# Altium schematic sheet [6] Audio, Full bridge.SchDoc
size A4; DocumentNumber: 9; SheetNumber: 9; SheetTotal: 10
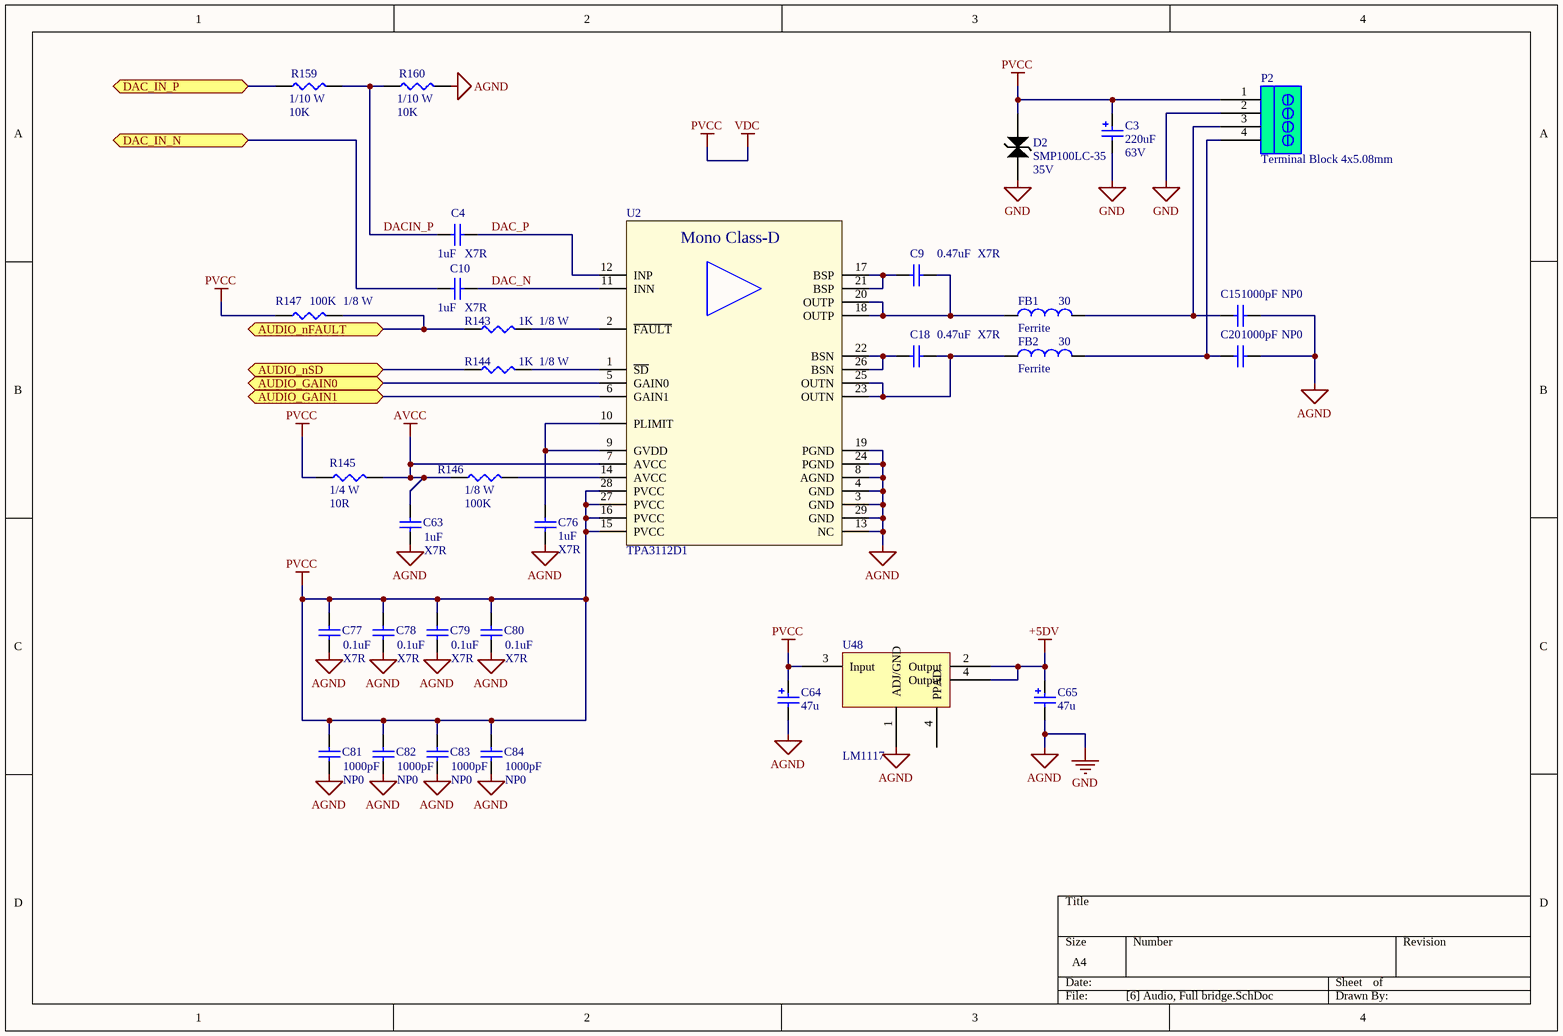
[diagram p0: [6] Audio, Full bridge.SchDoc]

## Parts
C3  value 220uF  Voltage: 63V  [CAPPR5-10x17_1]  (hidden comment: Cap Pol 100/47)
C4  value 1uF  Type: X7R  [CAP0805]  (hidden comment: CAP0805 1uF X7R)
C9  value 0.47uF  Type: X7R  [CAP0603]  (hidden comment: ChipCap 0.47u X7R)
C10  value 1uF  Type: X7R  [CAP0805]  (hidden comment: CAP0805 1uF X7R)
C15  value 1000pF  Type: NP0  [CAP0805]  (hidden comment: CAP0805 1000pF NP0)
C18  value 0.47uF  Type: X7R  [CAP0603]  (hidden comment: ChipCap 0.47u X7R)
C20  value 1000pF  Type: NP0  [CAP0805]  (hidden comment: CAP0805 1000pF NP0)
C63  value 1uF  Type: X7R  [CAP0805]  (hidden comment: CAP0805 1uF X7R)
C64  value 47u  [CAPC7343]  (hidden comment: Cap Pol SMD)
C65  value 47u  [CAPC7343]  (hidden comment: Cap Pol SMD)
C76  value 1uF  Type: X7R  [CAP0805]  (hidden comment: CAP0805 1uF X7R)
C77  value 0.1uF  Type: X7R  [CAP0805]  (hidden comment: CAP0805 0.1uF X7R)
C78  value 0.1uF  Type: X7R  [CAP0805]  (hidden comment: CAP0805 0.1uF X7R)
C79  value 0.1uF  Type: X7R  [CAP0805]  (hidden comment: CAP0805 0.1uF X7R)
C80  value 0.1uF  Type: X7R  [CAP0805]  (hidden comment: CAP0805 0.1uF X7R)
C81  value 1000pF  Type: NP0  [CAP0603]  (hidden comment: ChipCap 1000 NP0)
C82  value 1000pF  Type: NP0  [CAP0603]  (hidden comment: ChipCap 1000 NP0)
C83  value 1000pF  Type: NP0  [CAP0603]  (hidden comment: ChipCap 1000 NP0)
C84  value 1000pF  Type: NP0  [CAP0603]  (hidden comment: ChipCap 1000 NP0)
D2  SMP100LC-35  Voltage: 35V  [SMB1]
FB1  Ferrite  value 30  [RES0805]
FB2  Ferrite  value 30  [RES0805]
P2  Terminal Block 4x5.08mm  [Socket 4x5.08]
R143  value 1K  Rating: 1/8 W  [RES0805]  (hidden comment: RES0805 1K 1%)
R144  value 1K  Rating: 1/8 W  [RES0805]  (hidden comment: RES0805 1K 1%)
R145  value 10R  Rating: 1/4 W  [RES1206]  (hidden comment: RES1206 10R 1%)
R146  value 100K  Rating: 1/8 W  [RES0805]  (hidden comment: RES0805 100K 1%)
R147  value 100K  Rating: 1/8 W  [RES0805]  (hidden comment: RES0805 100K 1%)
R159  value 10K  Rating: 1/10 W  [RES0603]  (hidden comment: RES0603 10K 1%)
R160  value 10K  Rating: 1/10 W  [RES0603]  (hidden comment: RES0603 10K 1%)
U2  TPA3112D1  [TSSOP-28]
U48  LM1117  [SOT223-4M]

## Ports
AUDIO_GAIN0, AUDIO_GAIN1, AUDIO_nFAULT, AUDIO_nSD, DAC_IN_N, DAC_IN_P

## Nets
+5DV: C65.1 U48.2(Output) U48.4(PPAD)
AGND: C3.2 C15.2 C20.2 C63.1 C64.2 C65.2 C76.2 C77.1 C78.1 C79.1 C80.1 C81.1 C82.1 C83.1 C84.1 D2.1 P2.2 R160.2 U2.3(GND) U2.4(GND) U2.8(AGND) U2.13(NC) U2.19(PGND) U2.24(PGND) U2.29(GND) U48.1(ADJ/GND)  [also labelled GND]
AVCC: C63.2 R145.2 R146.1 U2.7(AVCC)
PVCC: C3.1 C64.1 C77.2 C78.2 C79.2 C80.2 C81.2 C82.2 C83.2 C84.2 D2.2 P2.1 R145.1 R147.1 U2.15(PVCC) U2.16(PVCC) U2.27(PVCC) U2.28(PVCC) U48.3(Input)  [also labelled VDC]
AUDIO_GAIN0: U2.5(GAIN0) ; port AUDIO_GAIN0
AUDIO_GAIN1: U2.6(GAIN1) ; port AUDIO_GAIN1
AUDIO_nFAULT: R143.1 R147.2 ; port AUDIO_nFAULT
AUDIO_nSD: R144.1 ; port AUDIO_nSD
DAC_IN_N: C10.1 ; port DAC_IN_N
DAC_IN_P: R159.1 ; port DAC_IN_P
DAC_N: C10.2 U2.11(INN)
DAC_P: C4.2 U2.12(INP)
DACIN_P: C4.1 R159.2 R160.1
NetC9_1: C9.1 U2.17(BSP) U2.21(BSP)
NetC9_2: C9.2 FB1.1 U2.18(OUTP) U2.20(OUTP)
NetC15_1: C15.1 FB1.2 P2.3
NetC18_1: C18.1 U2.22(BSN) U2.26(BSN)
NetC18_2: C18.2 FB2.1 U2.23(OUTN) U2.25(OUTN)
NetC20_1: C20.1 FB2.2 P2.4
NetC76_1: C76.1 U2.9(GVDD) U2.10(PLIMIT)
NetR143_2: R143.2 U2.2(~{FAULT})
NetR144_2: R144.2 U2.1(~{SD})
NetR146_2: R146.2 U2.14(AVCC)

## Notes on the sheet
- (in symbol TPA3112D1) Mono Class-D

## Library data of the parts
C3 = Cap Pol 100/47: Polarized Capacitor (Radial) Very low impedance; Manufacturer Part Number: SC063M0220A5S-1019; Supplier 1: Digi-Key; Supplier Part Number 1: P1284-ND
C4 C10 C63 C76 = CAP0805 1uF X7R: Surface-mount ceramic multilayer capacitor; Manufacturer: YAGEO; Manufacturer Part Number: CC0805KKX7R7BB105; Voltage: 16V; Tolerance: 5%; ComponentLink1Description: Datasheet; ComponentLink1URL: http://www.deaha.com/pdf/YAGEO-CC_series.pdf
C9 C18 = ChipCap 0.47uF X7R: Surface-mount ceramic multilayer capacitor; Manufacturer: YAGEO; Voltage: 100V; Tolerance: 10%; ComponentLink1Description: Datasheet; ComponentLink1URL: http://www.deaha.com/pdf/YAGEO-CC_series.pdf
C15 C20 = CAP0805 1000pF NP0: Surface-mount ceramic multilayer capacitor; Manufacturer: YAGEO; Manufacturer Part Number: CC0805JRNPO9BN102; Voltage: 50V; Tolerance: 5%; ComponentLink1Description: Datasheet; ComponentLink1URL: http://www.deaha.com/pdf/YAGEO-CC_series.pdf
C64 C65 = Cap Pol Chip: Polarized Capacitor (Radial); Supplier 1: Digi-Key; Supplier Part Number 1: 399-4029-1-ND
C77-C80 = CAP0805 0.1uF X7R: Surface-mount ceramic multilayer capacitor; Manufacturer: YAGEO; Manufacturer Part Number: CC0805JRX7R9BB104; Voltage: 50V; Tolerance: 5%; ComponentLink1Description: Datasheet; ComponentLink1URL: http://www.deaha.com/pdf/YAGEO-CC_series.pdf
C81-C84 = ChipCap 1000 X7R: Surface-mount ceramic multilayer capacitor; Manufacturer: YAGEO; Manufacturer Part Number: CC0603JRNPO0BN102; Voltage: 16V; Tolerance: 10%; ComponentLink1Description: Datasheet; ComponentLink1URL: http://www.deaha.com/pdf/YAGEO-CC_series.pdf
D2 = SMP100LC-35: Transient Voltage Suppressor 600W bi-directional; Tj: 150; Repetitive peak pulse current: 100A; Manufacturer Part Number: SMP100LC-35
FB1 FB2 = Ferrite Bead: Manufacturer: BOURNS; Manufacturer Part Number: MH2029-300Y; Raiting: 3000mA; Category: Ferrite Bead
P2 = Socket_4x5.08_RA_2Wall: Terminal Block Socket Right Angle 4x5.08mm 2-Wall
R143 R144 = RES0805 1K 1%: Think Film Chip resistor; Manufacturer Part Number: RC0805FR-071KL; Temperature Coefficient: 100ppm/K; Tolerance: 1%; Type: ThickFilm
R145 = RES1206 10R 1%: Think Film Chip resistor; Manufacturer Part Number: RC1206FR-0710RL; Temperature Coefficient: 100ppm/K; Tolerance: 1%; Type: ThickFilm
R146 = RES0805 100K 1%: Think Film Chip resistor; Manufacturer Part Number: RC0805FR-07100KL; Temperature Coefficient: 100ppm/K; Tolerance: 1%; Type: ThickFilm
R147 = RES0805 100R 1%: Think Film Chip resistor; Manufacturer Part Number: RC0805FR-07100RL; Temperature Coefficient: 100ppm/K; Tolerance: 1%; Type: ThickFilm
R159 R160 = RES0603 10K 1%: Think Film Chip resistor; Manufacturer Part Number: RC0603FR-0710KL (YAG); Temperature Coefficient: 100ppm/K; Tolerance: 1%; Type: ThickFilm
U2 = TPA3112D1: 25-W filter-free mono class-D audio power amplifier with speaker guard; Manufacturer Part Number: TPA3112D1PWP; Power: 25W; Channel: 1; Min load: 4 Ohm; Voltage: 8-26V; Category: ICs
U48 = LM1117: Power Mgt Voltage Regulator